# EAGLE design dongle (EAGLE 7.7.0)
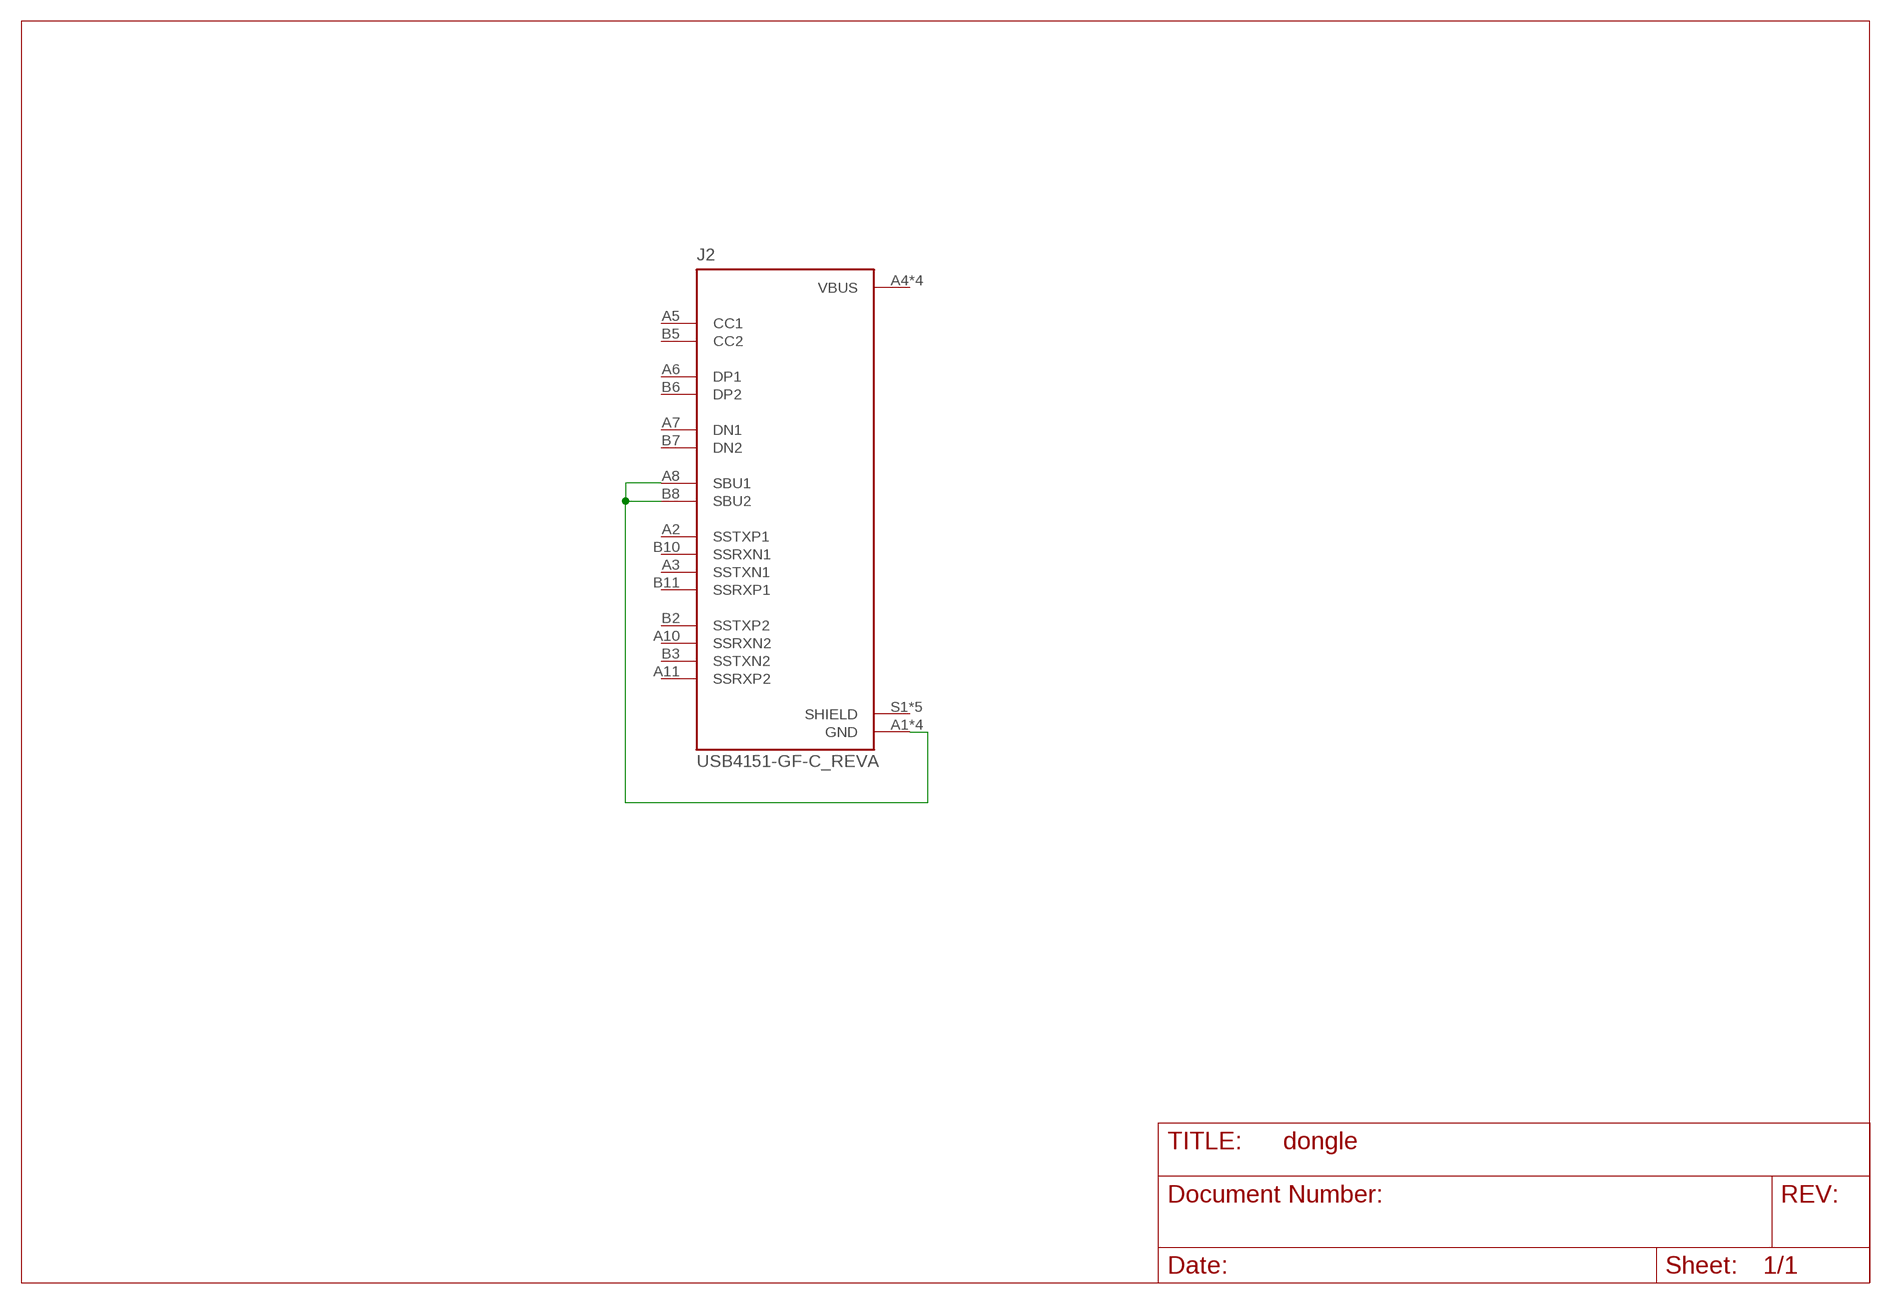
[diagram p0: schematic, sheet 1]

## Parts
J2  USB4151-GF-C_REVA  [GCT_USB4151-GF-C_REVA]

## Nets
N$1: J2.A1(GND) J2.A8(SBU1) J2.A12(GND) J2.B1(GND) J2.B8(SBU2) J2.B12(GND)
Unconnected: J2.A2(SSTXP1) J2.A3(SSTXN1) J2.A5(CC1) J2.A6(DP1) J2.A7(DN1) J2.A10(SSRXN2) J2.A11(SSRXP2) J2.B2(SSTXP2) J2.B3(SSTXN2) J2.B5(CC2) J2.B6(DP2) J2.B7(DN2) J2.B10(SSRXN1) J2.B11(SSRXP1) J2.S1(SHIELD) J2.S2(SHIELD) J2.S3(SHIELD) J2.S4(SHIELD) J2.S5(SHIELD)

## Power pins joined to a net without a drawn wire
VBUS: J2.A4(VBUS) J2.A9(VBUS) J2.B4(VBUS) J2.B9(VBUS)

## Library data of the parts
J2 = USB4151-GF-C_REVA:USB4151-GF-C_REVA: USB Type C Plug, Vertical, SMT Check availability <https://pricing.snapeda.com/parts/USB4151-GF-C/Global%20Connector%20Technology/view-part?ref=eda>; AVAILABILITY: In Stock; DESCRIPTION: USB Type C 3.1 vertical surface mount connector, 11.10mm profile, 24 Pins, Through hole; MF: Global Connector Technology; MP: USB4151-GF-C; PACKAGE: None; PRICE: None

## Board
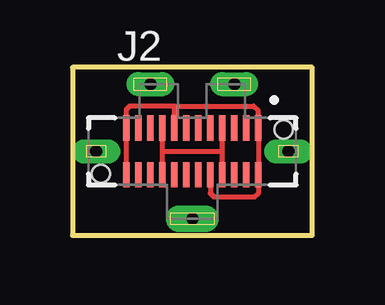
[diagram p1: board, top side]

Size 10 x 7 mm. Coordinates in mm from the lower left corner, seen from the top.
Outline: 0,0 10,0 10,7 0,7 0,0
Copper layers (1*16): Top 0.035mm / dielectric 1.5mm / Bottom 0.035mm
Design rules "default": minimum track width 10mil, minimum drill 24mil, track to track 8mil, track to pad 8mil, pad to pad 8mil, via to via 8mil, smd to smd 8mil, copper to edge 40mil, drill to drill 8mil, minimum pad ring 10mil, minimum via ring 8mil, stop-mask expansion 4mil, vias tented up to drill 0mil, thermal gap 10mil

### Footprints (pad centres in the part's own frame; a part is rotated, then mirrored left to right if it is on the bottom)
GCT_USB4151-GF-C_REVA = smd 0.28 x 1.05: A1 2.75,0.975; A2 2.25,0.975; A3 1.75,0.975; A4 1.25,0.975; A5 0.75,0.975; A6 0.25,0.975; A7 -0.25,0.975; A8 -0.75,0.975; A9 -1.25,0.975; A10 -1.75,0.975; A11 -2.25,0.975; A12 -2.75,0.975; B1 -2.75,-0.975; B2 -2.25,-0.975; B3 -1.75,-0.975; B4 -1.25,-0.975; B5 -0.75,-0.975; B6 -0.25,-0.975; B7 0.25,-0.975; B8 0.75,-0.975; B9 1.25,-0.975; B10 1.75,-0.975; B11 2.25,-0.975; B12 2.75,-0.975 | drill 0.5 pad 0.85 long: S1 -4.01,0; S4 4.01,0 | drill 0.5 pad 1 long: S2 -1.75,2.8; S3 1.75,2.8 | drill 0.5 pad 1.1 long: S5 0,-2.8 | hole 0.75: 3.81,0.92; -3.81,-0.93

### Placement (x,y rotation side)
J2  5,3.5 0 top

### Tracks (layer width: path | path; a pad name or v marks a point on that pad's centre or on a via)
N$1
  Top 0.2: J2.B1 J2.A12 2.25,5.25 2.4,5.4 4.25,5.4 J2.A8 4.25,5.38 4.24,5.39 7.57,5.39 7.75,5.21 J2.A1 J2.B12 7.75,1.75 7.6,1.6 5.9,1.6 5.75,1.75 J2.B8
VBUS
  Top 0.2: 3.75,3.5 J2.A9 | J2.B9 6.25,3.5 | 6.25,3.5 J2.A4 | J2.B4 3.75,3.5 | 3.75,3.5 6.25,3.5